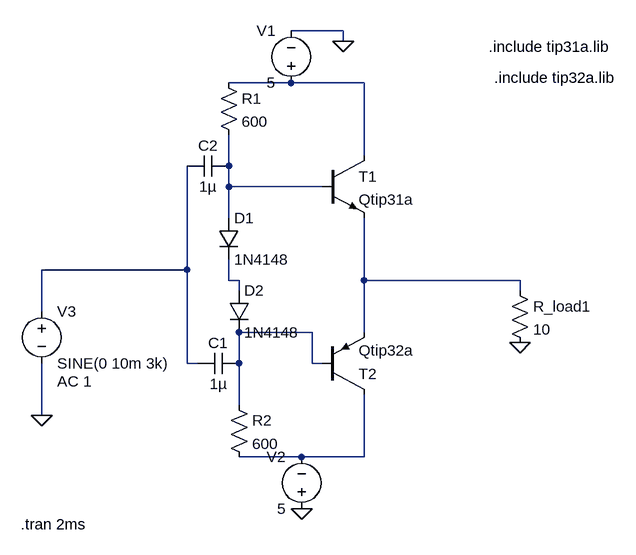
[diagram p0: schematic stage4_power_amp.asc]
stage4_power_amp.asc, the LTspice schematic file:
Version 4
SHEET 1 880 680
WIRE 176 -160 96 -160
WIRE 176 -144 176 -160
WIRE 96 -80 0 -80
WIRE 208 -80 96 -80
WIRE 208 32 208 -80
WIRE 0 48 0 0
WIRE 0 80 0 48
WIRE 144 80 0 80
WIRE 0 128 0 80
WIRE -64 208 -64 48
WIRE -64 208 -288 208
WIRE 0 224 0 192
WIRE 16 224 0 224
WIRE 208 224 208 128
WIRE 448 224 208 224
WIRE 16 240 16 224
WIRE 448 240 448 224
WIRE -288 272 -288 208
WIRE 128 304 16 304
WIRE 208 304 208 224
WIRE -64 352 -64 208
WIRE -48 352 -64 352
WIRE 16 352 16 304
WIRE 128 352 128 304
WIRE 144 352 128 352
WIRE 16 416 16 352
WIRE -288 432 -288 352
WIRE 112 496 16 496
WIRE 208 496 208 400
WIRE 208 496 112 496
FLAG 448 320 0
FLAG 112 576 0
FLAG 176 -144 0
FLAG -288 432 0
SYMBOL diode -16 128 R0
SYMATTR InstName D1
SYMATTR Value 1N4148
SYMBOL diode 0 240 R0
SYMATTR InstName D2
SYMATTR Value 1N4148
SYMBOL res -16 -96 R0
SYMATTR InstName R1
SYMATTR Value 600
SYMBOL res 0 400 R0
SYMATTR InstName R2
SYMATTR Value 600
SYMBOL npn 144 32 R0
SYMATTR InstName T1
SYMATTR Value Qtip31a
SYMBOL pnp 144 400 M180
SYMATTR InstName T2
SYMATTR Value Qtip32a
SYMBOL res 432 224 R0
SYMATTR InstName R_load1
SYMATTR Value 10
SYMBOL voltage 96 -64 R180
WINDOW 0 24 96 Left 2
WINDOW 3 24 16 Left 2
WINDOW 123 0 0 Left 0
WINDOW 39 0 0 Left 0
SYMATTR InstName V1
SYMATTR Value 5
SYMBOL voltage 112 592 R180
WINDOW 0 24 96 Left 2
WINDOW 3 24 16 Left 2
WINDOW 123 0 0 Left 0
WINDOW 39 0 0 Left 0
SYMATTR InstName V2
SYMATTR Value 5
SYMBOL cap 16 336 R90
WINDOW 0 0 32 VBottom 2
WINDOW 3 32 32 VTop 2
SYMATTR InstName C1
SYMATTR Value 1µ
SYMBOL cap 0 32 R90
WINDOW 0 0 32 VBottom 2
WINDOW 3 32 32 VTop 2
SYMATTR InstName C2
SYMATTR Value 1µ
SYMBOL voltage -288 256 R0
WINDOW 123 24 124 Left 2
WINDOW 39 0 0 Left 0
SYMATTR Value2 AC 1
SYMATTR InstName V3
SYMATTR Value SINE(0 10m 3k)
TEXT 400 -136 Left 2 !.include tip31a.lib
TEXT 408 -88 Left 2 !.include tip32a.lib
TEXT -320 600 Left 2 !.tran 2ms

The netlist it stands for:
* stage4_power_amp.asc
D1 N002 N004 1N4148
D2 N004 N006 1N4148
R1 N001 N002 600
R2 N006 N007 600
Q§T1 N001 N002 N005 0 Qtip31a
Q§T2 N007 N006 N005 0 Qtip32a
R_load1 N005 0 10
V1 N001 0 5
V2 0 N007 5
C1 N006 N003 1µ
C2 N002 N003 1µ
V3 N003 0 SINE(0 10m 3k) AC 1
.model D D
.lib standard.dio
.model NPN NPN
.model PNP PNP
.lib standard.bjt
.include tip31a.lib
.include tip32a.lib
.tran 2ms
.backanno
.end